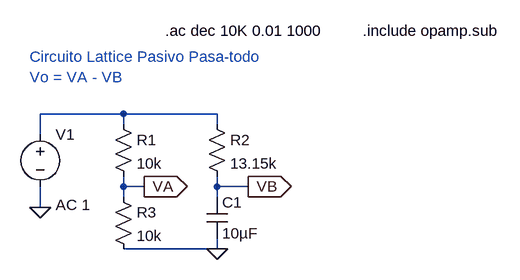
[diagram p0: schematic EJE1_Pasiva.asc]
EJE1_Pasiva.asc, the LTspice schematic file:
Version 4
SHEET 1 880 680
WIRE -16 144 -144 144
WIRE 128 144 -16 144
WIRE -16 160 -16 144
WIRE 128 160 128 144
WIRE -144 176 -144 144
WIRE -16 256 -16 240
WIRE 16 256 -16 256
WIRE 128 256 128 240
WIRE 176 256 128 256
WIRE -16 272 -16 256
WIRE 128 272 128 256
WIRE -144 288 -144 256
WIRE 128 352 128 336
WIRE 128 352 -16 352
FLAG -144 288 0
FLAG 128 352 0
FLAG 16 256 VA
IOPIN 16 256 Out
FLAG 176 256 VB
IOPIN 176 256 Out
SYMBOL voltage -144 160 R0
WINDOW 123 24 124 Left 2
WINDOW 39 0 0 Left 0
SYMATTR Value2 AC 1
SYMATTR InstName V1
SYMATTR Value ""
SYMBOL res -32 144 R0
SYMATTR InstName R1
SYMATTR Value 10k
SYMBOL res -32 256 R0
SYMATTR InstName R3
SYMATTR Value 10k
SYMBOL res 112 144 R0
SYMATTR InstName R2
SYMATTR Value 13.15k
SYMBOL cap 112 272 R0
SYMATTR InstName C1
SYMATTR Value 10µF
TEXT 48 16 Left 2 !.ac dec 10K 0.01 1000
TEXT 352 16 Left 2 !.include opamp.sub
TEXT -160 56 Left 2 ;Circuito Lattice Pasivo Pasa-todo\nVo = VA - VB

The netlist it stands for:
* EJE1_Pasiva.asc
V1 N001 0 AC 1
R1 N001 VA 10k
R3 VA 0 10k
R2 N001 VB 13.15k
C1 VB 0 10µF
.ac dec 10K 0.01 1000
.include opamp.sub
* Circuito Lattice Pasivo Pasa-todo
* Vo = VA - VB
.backanno
.end